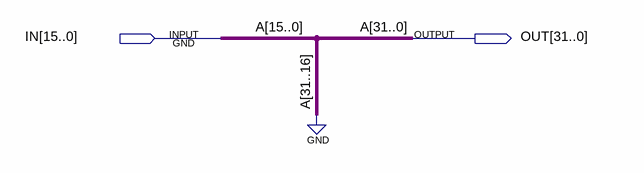
[diagram p0: schematic sheet]
// Quartus schematic zeroext16_32.bdf as structural Verilog: 0 symbols, 2 pins
module zeroext16_32 (
  input  [15:0] IN,
  output [31:0] OUT
);


  assign OUT = {{16{1'b0}}, IN};

  // Other names for the same wires on the sheet: A[15:0] = IN
endmodule
